# EAGLE schematic dac (EAGLE 9.5.1)
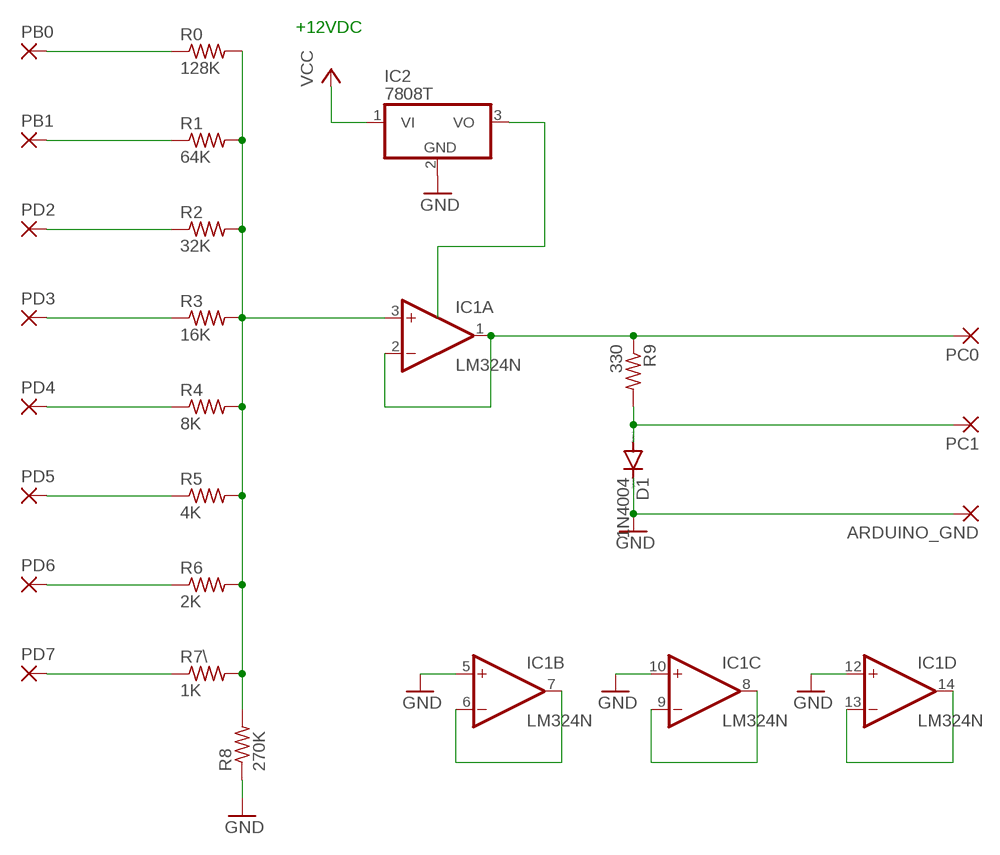
[diagram p0: schematic, sheet 1]

## Parts
ARDUINO_GND  1,6/0,8  [1,6/0,8]
D1  1N4004  [DO41-10]
IC1  LM324N  [DIL14]
IC2  7808T  [TO220H]
PB0  1,6/0,8  [1,6/0,8]
PB1  1,6/0,8  [1,6/0,8]
PC0  1,6/0,8  [1,6/0,8]
PC1  1,6/0,8  [1,6/0,8]
PD2  1,6/0,8  [1,6/0,8]
PD3  1,6/0,8  [1,6/0,8]
PD4  1,6/0,8  [1,6/0,8]
PD5  1,6/0,8  [1,6/0,8]
PD6  1,6/0,8  [1,6/0,8]
PD7  1,6/0,8  [1,6/0,8]
R0  128K  R-US_0204/7  [0204/7]
R1  64K  R-US_0204/7  [0204/7]
R2  32K  R-US_0204/7  [0204/7]
R3  16K  R-US_0204/7  [0204/7]
R4  8K  R-US_0204/7  [0204/7]
R5  4K  R-US_0204/7  [0204/7]
R6  2K  R-US_0204/7  [0204/7]
R7\  1K  R-US_0204/7  [0204/7]
R8  270K  R-US_0204/7  [0204/7]
R9  330  R-US_0204/7  [0204/7]

## Nets
GND: ARDUINO_GND.1(P) D1.C IC1.5(B:+IN) IC1.10(C:+IN) IC1.12(D:+IN) IC2.2(GND) R8.1
N$1: IC1.3(A:+IN) R0.2 R1.2 R2.2 R3.2 R4.2 R5.2 R6.2 R7\.2 R8.2
N$2: PB0.1(P) R0.1
N$3: PB1.1(P) R1.1
N$4: PD2.1(P) R2.1
N$5: PD3.1(P) R3.1
N$6: PD4.1(P) R4.1
N$7: PD5.1(P) R5.1
N$8: PD6.1(P) R6.1
N$9: PD7.1(P) R7\.1
N$10: IC1.1(A:OUT) IC1.2(A:-IN) PC0.1(P) R9.1
N$11: IC2.3(VO)
N$12: IC1.6(B:-IN) IC1.7(B:OUT)
N$13: IC1.8(C:OUT) IC1.9(C:-IN)
N$14: IC1.13(D:-IN) IC1.14(D:OUT)
N$15: D1.A PC1.1(P) R9.2
VCC: IC2.1(VI)

## Notes on the sheet
- +12VDC

## Power pins joined to a net without a drawn wire
V+: IC1.4(P:V+)
V-: IC1.11(P:V-)

## Library data of the parts
ARDUINO_GND PB0 PB1 PC0 PC1 PD2-PD7 = wirepad:1,6/0,8: THROUGH-HOLE PAD
D1 = diode:1N4004: DIODE general purpose rectifier, 1 A
IC1 = linear:LM324: OP AMP
IC2 = linear:78*: Positive VOLTAGE REGULATOR Source: http://cache.national.com/ds/LM/LM78L05.pdf http://www.fairchildsemi.com/ds/LM/LM7805.pdf
R0 R1-R6 R7\ R8 R9 = rcl:R-US_: RESISTOR, American symbol; SPICEPREFIX: R